# Altium schematic sheet BME680.SchDoc: Sensor Temp / humedad
size A4; CompanyName: MUISE; Engineer: Manuel Viqueira Rodríguez; Organization: ETSI Telecomunicaciones; Address1: Av. Complutense, 30; Address2: , 28040 Madrid; Address3: Madrid; Address4: España; DocumentNumber: 8; Revision: V1.0; SheetNumber: 8; SheetTotal: 8; Engineer2: Marcos Vazquez Nuñez
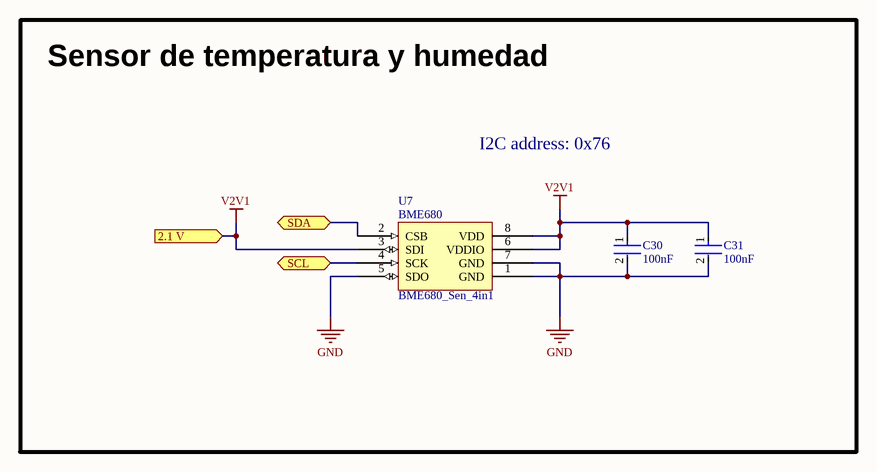
[diagram p0: BME680.SchDoc]

## Parts
C30  100nF  [FP-CL10-IPC_B]
C31  100nF  [FP-CL10-IPC_B]
U7  BME680_Sen_4in1  [BME_LGA8]

## Blocks framed on the sheet
Sensor de temperatura y humedad: C30 C31 U7

## Ports
2.1 V (in), SCL (bidir), SDA (bidir)

## Nets
GND: C30.2 C31.2 U7.1(GND) U7.5(SDO) U7.7(GND)
V2V1: C30.1 C31.1 U7.3(SDI) U7.6(VDDIO) U7.8(VDD) ; port 2.1 V
SCL: U7.4(SCK) ; port SCL
SDA: U7.2(CSB) ; port SDA

## Notes on the sheet
- I2C address: 0x76
- Size:
- Date:
- Title
- A4
- Number:
- Time:
- Revision:
- Sheet
- of
- Engineer
- File:
- (in symbol BME680_Sen_4in1) BME680

## Library data of the parts
C30 C31 = CMP-13271-003245-1: Cap Ceramic 10uF 10V X5R ±10% Pad SMD 0603 +85°C T/R; Packaging: Tape and Reel; Dielectric: X5R; Min Operating Temperature: -55°C; Lead Free: Lead Free; Height: 0.8mm; Package Quantity: 10000; Voltage Rating (DC): 10V; Mount: Surface Mount; Tolerance: 10%; Width: 0.031inch; Thickness: 0.035inch; Depth: 0.8mm; Max Operating Temperature: 85°C; Capacitance: 10uF; Case/Package: 0603; Length: 1.6mm; Voltage Rating: 10V; Radiation Hardening: No